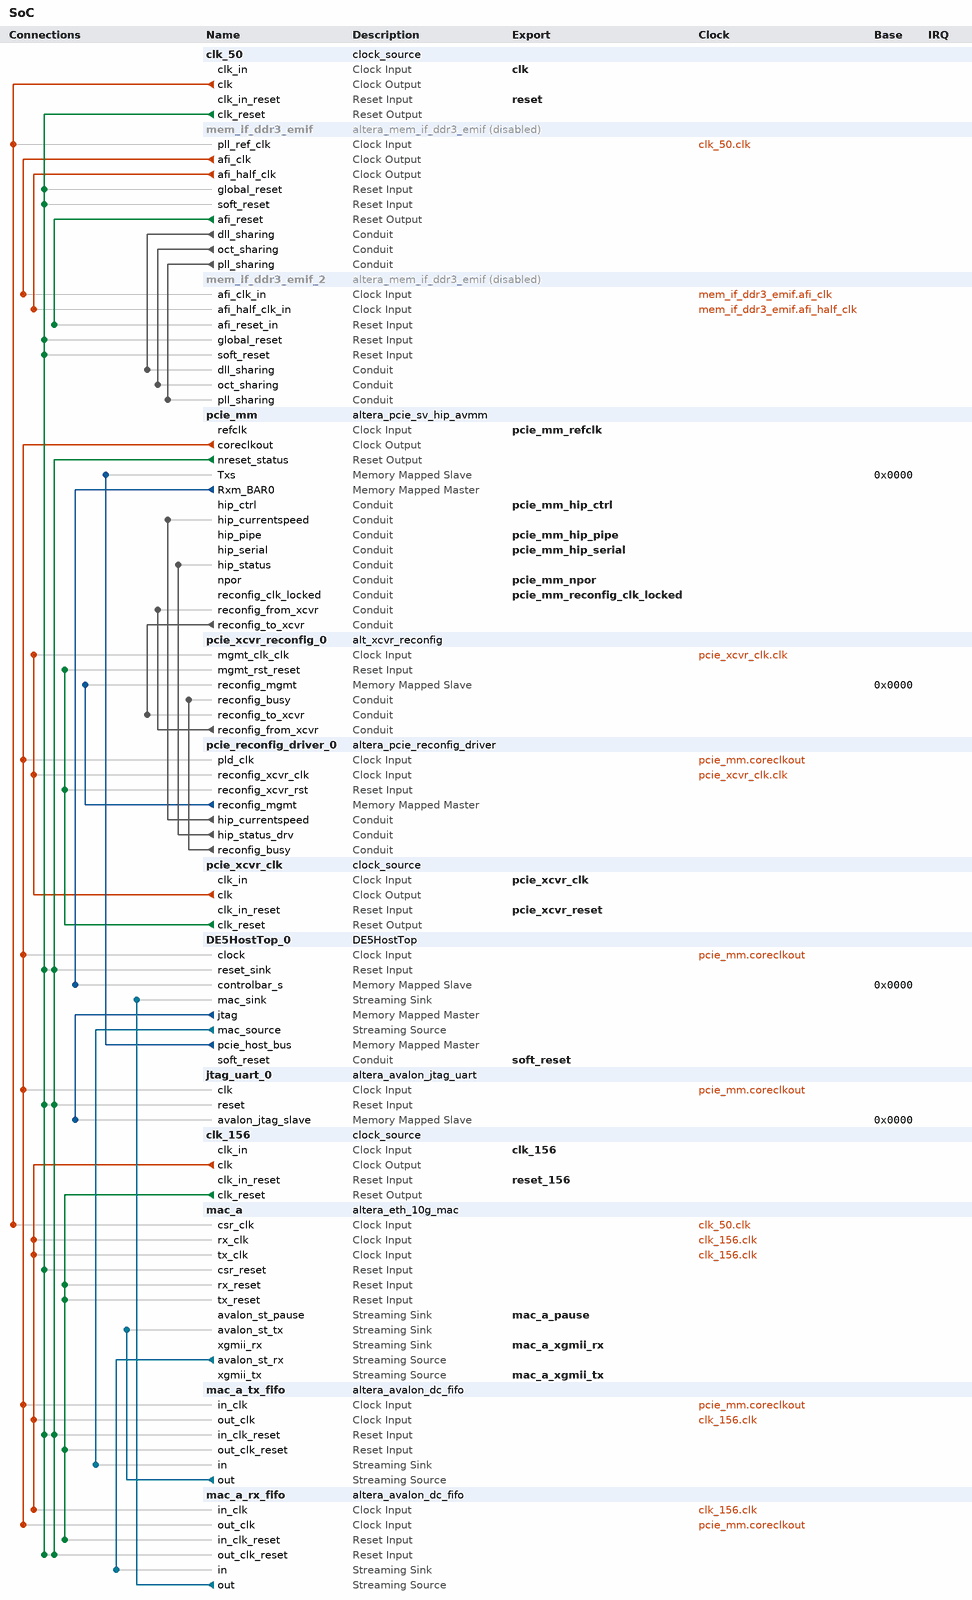
[diagram p0: system contents]
# Platform Designer (Qsys) system SoC, Stratix V 5SGXEA7N2F45C2
# Parameters at their usual value, and those the tool derives, are not listed.
package require -exact qsys 16.0
create_system SoC
set_project_property DEVICE_FAMILY {Stratix V}
set_project_property DEVICE 5SGXEA7N2F45C2

add_instance clk_50 clock_source 16.0
set_instance_parameter_value clk_50 clockFrequency 50000000

add_instance mem_if_ddr3_emif altera_mem_if_ddr3_emif 16.0
set_instance_property mem_if_ddr3_emif ENABLED false
set_instance_parameter_value mem_if_ddr3_emif AVL_MAX_SIZE 8
set_instance_parameter_value mem_if_ddr3_emif CALIBRATION_MODE Skip
set_instance_parameter_value mem_if_ddr3_emif CPORT_TYPE_PORT Bidirectional,Bidirectional,Bidirectional,Bidirectional,Bidirectional,Bidirectional
set_instance_parameter_value mem_if_ddr3_emif DLL_SHARING_MODE Master
set_instance_parameter_value mem_if_ddr3_emif EXPORT_AFI_HALF_CLK false
set_instance_parameter_value mem_if_ddr3_emif HARD_EMIF false
set_instance_parameter_value mem_if_ddr3_emif MEM_BANKADDR_WIDTH 3
set_instance_parameter_value mem_if_ddr3_emif MEM_CLK_FREQ 540.0
set_instance_parameter_value mem_if_ddr3_emif MEM_CLK_FREQ_MAX 800.0
set_instance_parameter_value mem_if_ddr3_emif MEM_COL_ADDR_WIDTH 10
set_instance_parameter_value mem_if_ddr3_emif MEM_DQ_WIDTH 64
set_instance_parameter_value mem_if_ddr3_emif MEM_FORMAT UNBUFFERED
set_instance_parameter_value mem_if_ddr3_emif MEM_ROW_ADDR_WIDTH 14
set_instance_parameter_value mem_if_ddr3_emif MEM_TCL 11
set_instance_parameter_value mem_if_ddr3_emif MEM_TFAW_NS 30.0
set_instance_parameter_value mem_if_ddr3_emif MEM_TRAS_NS 35.0
set_instance_parameter_value mem_if_ddr3_emif MEM_TRCD_NS 13.75
set_instance_parameter_value mem_if_ddr3_emif MEM_TRFC_NS 160.0
set_instance_parameter_value mem_if_ddr3_emif MEM_TRP_NS 13.75
set_instance_parameter_value mem_if_ddr3_emif MEM_TRRD_NS 6.0
set_instance_parameter_value mem_if_ddr3_emif MEM_TRTP_NS 7.5
set_instance_parameter_value mem_if_ddr3_emif MEM_TWTR 4
set_instance_parameter_value mem_if_ddr3_emif MEM_VENDOR Micron
set_instance_parameter_value mem_if_ddr3_emif MEM_WTCL 8
set_instance_parameter_value mem_if_ddr3_emif OCT_SHARING_MODE Master
set_instance_parameter_value mem_if_ddr3_emif PLL_LOCATION Left_Right
set_instance_parameter_value mem_if_ddr3_emif PLL_SHARING_MODE Master
set_instance_parameter_value mem_if_ddr3_emif POWER_OF_TWO_BUS true
set_instance_parameter_value mem_if_ddr3_emif PRIORITY_PORT 0,1,1,1,1,1
set_instance_parameter_value mem_if_ddr3_emif RATE Half
set_instance_parameter_value mem_if_ddr3_emif REF_CLK_FREQ 50.0
set_instance_parameter_value mem_if_ddr3_emif SPEED_GRADE 2
set_instance_parameter_value mem_if_ddr3_emif TIMING_BOARD_AC_SKEW 0.05
set_instance_parameter_value mem_if_ddr3_emif TIMING_BOARD_AC_TO_CK_SKEW 0.012
set_instance_parameter_value mem_if_ddr3_emif TIMING_BOARD_DQ_TO_DQS_SKEW 0.002
set_instance_parameter_value mem_if_ddr3_emif TIMING_BOARD_MAX_CK_DELAY 1.78
set_instance_parameter_value mem_if_ddr3_emif TIMING_BOARD_MAX_DQS_DELAY 0.7
set_instance_parameter_value mem_if_ddr3_emif TIMING_BOARD_SKEW_BETWEEN_DQS 0.1
set_instance_parameter_value mem_if_ddr3_emif TIMING_BOARD_SKEW_CKDQS_DIMM_MAX 1.29
set_instance_parameter_value mem_if_ddr3_emif TIMING_BOARD_SKEW_CKDQS_DIMM_MIN 0.06
set_instance_parameter_value mem_if_ddr3_emif TIMING_BOARD_SKEW_WITHIN_DQS 0.009
set_instance_parameter_value mem_if_ddr3_emif TIMING_TDH 45
set_instance_parameter_value mem_if_ddr3_emif TIMING_TDQSCK 255
set_instance_parameter_value mem_if_ddr3_emif TIMING_TDQSQ 100
set_instance_parameter_value mem_if_ddr3_emif TIMING_TDQSS 0.27
set_instance_parameter_value mem_if_ddr3_emif TIMING_TDS 10
set_instance_parameter_value mem_if_ddr3_emif TIMING_TDSH 0.18
set_instance_parameter_value mem_if_ddr3_emif TIMING_TDSS 0.18
set_instance_parameter_value mem_if_ddr3_emif TIMING_TIH 120
set_instance_parameter_value mem_if_ddr3_emif TIMING_TIS 170
set_instance_parameter_value mem_if_ddr3_emif TIMING_TQSH 0.4
set_instance_parameter_value mem_if_ddr3_emif USER_DEBUG_LEVEL 0

add_instance mem_if_ddr3_emif_2 altera_mem_if_ddr3_emif 16.0
set_instance_property mem_if_ddr3_emif_2 ENABLED false
set_instance_parameter_value mem_if_ddr3_emif_2 AVL_MAX_SIZE 8
set_instance_parameter_value mem_if_ddr3_emif_2 CALIBRATION_MODE Skip
set_instance_parameter_value mem_if_ddr3_emif_2 CPORT_TYPE_PORT Bidirectional,Bidirectional,Bidirectional,Bidirectional,Bidirectional,Bidirectional
set_instance_parameter_value mem_if_ddr3_emif_2 DLL_SHARING_MODE Slave
set_instance_parameter_value mem_if_ddr3_emif_2 EXPORT_AFI_HALF_CLK false
set_instance_parameter_value mem_if_ddr3_emif_2 HARD_EMIF false
set_instance_parameter_value mem_if_ddr3_emif_2 MEM_BANKADDR_WIDTH 3
set_instance_parameter_value mem_if_ddr3_emif_2 MEM_CLK_FREQ 540.0
set_instance_parameter_value mem_if_ddr3_emif_2 MEM_CLK_FREQ_MAX 800.0
set_instance_parameter_value mem_if_ddr3_emif_2 MEM_COL_ADDR_WIDTH 10
set_instance_parameter_value mem_if_ddr3_emif_2 MEM_DQ_WIDTH 64
set_instance_parameter_value mem_if_ddr3_emif_2 MEM_FORMAT UNBUFFERED
set_instance_parameter_value mem_if_ddr3_emif_2 MEM_ROW_ADDR_WIDTH 14
set_instance_parameter_value mem_if_ddr3_emif_2 MEM_TCL 11
set_instance_parameter_value mem_if_ddr3_emif_2 MEM_TFAW_NS 30.0
set_instance_parameter_value mem_if_ddr3_emif_2 MEM_TRAS_NS 35.0
set_instance_parameter_value mem_if_ddr3_emif_2 MEM_TRCD_NS 13.75
set_instance_parameter_value mem_if_ddr3_emif_2 MEM_TRFC_NS 160.0
set_instance_parameter_value mem_if_ddr3_emif_2 MEM_TRP_NS 13.75
set_instance_parameter_value mem_if_ddr3_emif_2 MEM_TRRD_NS 6.0
set_instance_parameter_value mem_if_ddr3_emif_2 MEM_TRTP_NS 7.5
set_instance_parameter_value mem_if_ddr3_emif_2 MEM_TWTR 4
set_instance_parameter_value mem_if_ddr3_emif_2 MEM_VENDOR Micron
set_instance_parameter_value mem_if_ddr3_emif_2 MEM_WTCL 8
set_instance_parameter_value mem_if_ddr3_emif_2 OCT_SHARING_MODE Slave
set_instance_parameter_value mem_if_ddr3_emif_2 PLL_LOCATION Left_Right
set_instance_parameter_value mem_if_ddr3_emif_2 PLL_SHARING_MODE Slave
set_instance_parameter_value mem_if_ddr3_emif_2 POWER_OF_TWO_BUS true
set_instance_parameter_value mem_if_ddr3_emif_2 PRIORITY_PORT 0,1,1,1,1,1
set_instance_parameter_value mem_if_ddr3_emif_2 RATE Half
set_instance_parameter_value mem_if_ddr3_emif_2 REF_CLK_FREQ 50.0
set_instance_parameter_value mem_if_ddr3_emif_2 SPEED_GRADE 2
set_instance_parameter_value mem_if_ddr3_emif_2 TIMING_BOARD_AC_SKEW 0.05
set_instance_parameter_value mem_if_ddr3_emif_2 TIMING_BOARD_AC_TO_CK_SKEW 0.012
set_instance_parameter_value mem_if_ddr3_emif_2 TIMING_BOARD_DQ_TO_DQS_SKEW 0.002
set_instance_parameter_value mem_if_ddr3_emif_2 TIMING_BOARD_MAX_CK_DELAY 1.78
set_instance_parameter_value mem_if_ddr3_emif_2 TIMING_BOARD_MAX_DQS_DELAY 0.7
set_instance_parameter_value mem_if_ddr3_emif_2 TIMING_BOARD_SKEW_BETWEEN_DQS 0.1
set_instance_parameter_value mem_if_ddr3_emif_2 TIMING_BOARD_SKEW_CKDQS_DIMM_MAX 1.29
set_instance_parameter_value mem_if_ddr3_emif_2 TIMING_BOARD_SKEW_CKDQS_DIMM_MIN 0.06
set_instance_parameter_value mem_if_ddr3_emif_2 TIMING_BOARD_SKEW_WITHIN_DQS 0.009
set_instance_parameter_value mem_if_ddr3_emif_2 TIMING_TDH 45
set_instance_parameter_value mem_if_ddr3_emif_2 TIMING_TDQSCK 255
set_instance_parameter_value mem_if_ddr3_emif_2 TIMING_TDQSQ 100
set_instance_parameter_value mem_if_ddr3_emif_2 TIMING_TDQSS 0.27
set_instance_parameter_value mem_if_ddr3_emif_2 TIMING_TDS 10
set_instance_parameter_value mem_if_ddr3_emif_2 TIMING_TDSH 0.18
set_instance_parameter_value mem_if_ddr3_emif_2 TIMING_TDSS 0.18
set_instance_parameter_value mem_if_ddr3_emif_2 TIMING_TIH 120
set_instance_parameter_value mem_if_ddr3_emif_2 TIMING_TIS 170
set_instance_parameter_value mem_if_ddr3_emif_2 TIMING_TQSH 0.4
set_instance_parameter_value mem_if_ddr3_emif_2 USER_DEBUG_LEVEL 0

add_instance pcie_mm altera_pcie_sv_hip_avmm 16.0
set_instance_parameter_value pcie_mm AST_LITE 0
set_instance_parameter_value pcie_mm AVALON_ADDR_WIDTH 64
set_instance_parameter_value pcie_mm AddressPage "0\\,1\\,2\\,3\\,4\\,5\\,6\\,7\\,8\\,9\\,10\\,11\\,12\\,13\\,14\\,15"
set_instance_parameter_value pcie_mm BYPASSS_A2P_TRANSLATION 0
set_instance_parameter_value pcie_mm CB_A2P_ADDR_MAP_FIXED_TABLE_0_HIGH 0
set_instance_parameter_value pcie_mm CB_A2P_ADDR_MAP_FIXED_TABLE_0_LOW 0
set_instance_parameter_value pcie_mm CB_A2P_ADDR_MAP_FIXED_TABLE_10_HIGH 0
set_instance_parameter_value pcie_mm CB_A2P_ADDR_MAP_FIXED_TABLE_10_LOW 0
set_instance_parameter_value pcie_mm CB_A2P_ADDR_MAP_FIXED_TABLE_11_HIGH 0
set_instance_parameter_value pcie_mm CB_A2P_ADDR_MAP_FIXED_TABLE_11_LOW 0
set_instance_parameter_value pcie_mm CB_A2P_ADDR_MAP_FIXED_TABLE_12_HIGH 0
set_instance_parameter_value pcie_mm CB_A2P_ADDR_MAP_FIXED_TABLE_12_LOW 0
set_instance_parameter_value pcie_mm CB_A2P_ADDR_MAP_FIXED_TABLE_13_HIGH 0
set_instance_parameter_value pcie_mm CB_A2P_ADDR_MAP_FIXED_TABLE_13_LOW 0
set_instance_parameter_value pcie_mm CB_A2P_ADDR_MAP_FIXED_TABLE_14_HIGH 0
set_instance_parameter_value pcie_mm CB_A2P_ADDR_MAP_FIXED_TABLE_14_LOW 0
set_instance_parameter_value pcie_mm CB_A2P_ADDR_MAP_FIXED_TABLE_15_HIGH 0
set_instance_parameter_value pcie_mm CB_A2P_ADDR_MAP_FIXED_TABLE_15_LOW 0
set_instance_parameter_value pcie_mm CB_A2P_ADDR_MAP_FIXED_TABLE_1_HIGH 0
set_instance_parameter_value pcie_mm CB_A2P_ADDR_MAP_FIXED_TABLE_1_LOW 0
set_instance_parameter_value pcie_mm CB_A2P_ADDR_MAP_FIXED_TABLE_2_HIGH 0
set_instance_parameter_value pcie_mm CB_A2P_ADDR_MAP_FIXED_TABLE_2_LOW 0
set_instance_parameter_value pcie_mm CB_A2P_ADDR_MAP_FIXED_TABLE_3_HIGH 0
set_instance_parameter_value pcie_mm CB_A2P_ADDR_MAP_FIXED_TABLE_3_LOW 0
set_instance_parameter_value pcie_mm CB_A2P_ADDR_MAP_FIXED_TABLE_4_HIGH 0
set_instance_parameter_value pcie_mm CB_A2P_ADDR_MAP_FIXED_TABLE_4_LOW 0
set_instance_parameter_value pcie_mm CB_A2P_ADDR_MAP_FIXED_TABLE_5_HIGH 0
set_instance_parameter_value pcie_mm CB_A2P_ADDR_MAP_FIXED_TABLE_5_LOW 0
set_instance_parameter_value pcie_mm CB_A2P_ADDR_MAP_FIXED_TABLE_6_HIGH 0
set_instance_parameter_value pcie_mm CB_A2P_ADDR_MAP_FIXED_TABLE_6_LOW 0
set_instance_parameter_value pcie_mm CB_A2P_ADDR_MAP_FIXED_TABLE_7_HIGH 0
set_instance_parameter_value pcie_mm CB_A2P_ADDR_MAP_FIXED_TABLE_7_LOW 0
set_instance_parameter_value pcie_mm CB_A2P_ADDR_MAP_FIXED_TABLE_8_HIGH 0
set_instance_parameter_value pcie_mm CB_A2P_ADDR_MAP_FIXED_TABLE_8_LOW 0
set_instance_parameter_value pcie_mm CB_A2P_ADDR_MAP_FIXED_TABLE_9_HIGH 0
set_instance_parameter_value pcie_mm CB_A2P_ADDR_MAP_FIXED_TABLE_9_LOW 0
set_instance_parameter_value pcie_mm CB_A2P_ADDR_MAP_IS_FIXED 0
set_instance_parameter_value pcie_mm CB_A2P_ADDR_MAP_NUM_ENTRIES 2
set_instance_parameter_value pcie_mm CB_A2P_ADDR_MAP_PASS_THRU_BITS 20
set_instance_parameter_value pcie_mm CB_P2A_AVALON_ADDR_B0 0x00000000
set_instance_parameter_value pcie_mm CB_P2A_AVALON_ADDR_B1 0x00000000
set_instance_parameter_value pcie_mm CB_P2A_AVALON_ADDR_B2 0x00000000
set_instance_parameter_value pcie_mm CB_P2A_AVALON_ADDR_B3 0x00000000
set_instance_parameter_value pcie_mm CB_P2A_AVALON_ADDR_B4 0x00000000
set_instance_parameter_value pcie_mm CB_P2A_AVALON_ADDR_B5 0x00000000
set_instance_parameter_value pcie_mm CB_P2A_FIXED_AVALON_ADDR_B0 0
set_instance_parameter_value pcie_mm CB_P2A_FIXED_AVALON_ADDR_B1 0
set_instance_parameter_value pcie_mm CB_P2A_FIXED_AVALON_ADDR_B2 0
set_instance_parameter_value pcie_mm CB_P2A_FIXED_AVALON_ADDR_B3 0
set_instance_parameter_value pcie_mm CB_P2A_FIXED_AVALON_ADDR_B4 0
set_instance_parameter_value pcie_mm CB_P2A_FIXED_AVALON_ADDR_B5 0
set_instance_parameter_value pcie_mm CB_PCIE_MODE 0
set_instance_parameter_value pcie_mm CB_PCIE_RX_LITE 0
set_instance_parameter_value pcie_mm CB_RP_S_ADDR_WIDTH 32
set_instance_parameter_value pcie_mm CG_COMMON_CLOCK_MODE 1
set_instance_parameter_value pcie_mm CG_ENABLE_A2P_INTERRUPT 0
set_instance_parameter_value pcie_mm CG_ENABLE_ADVANCED_INTERRUPT 0
set_instance_parameter_value pcie_mm CG_ENABLE_HIP_STATUS 1
set_instance_parameter_value pcie_mm CG_ENABLE_HIP_STATUS_EXTENSION 0
set_instance_parameter_value pcie_mm CG_IMPL_CRA_AV_SLAVE_PORT 0
set_instance_parameter_value pcie_mm CG_RXM_IRQ_NUM 16
set_instance_parameter_value pcie_mm NUM_PREFETCH_MASTERS 1
set_instance_parameter_value pcie_mm PCIeAddress31_0 "0x00000000\\,0x00000000\\,0x00000000\\,0x00000000\\,0x00000000\\,0x00000000\\,0x00000000\\,0x00000000\\,0x00000000\\,0x00000000\\,0x00000000\\,0x00000000\\,0x00000000\\,0x00000000\\,0x00000000\\,0x00000000"
set_instance_parameter_value pcie_mm PCIeAddress63_32 "0x00000000\\,0x00000000\\,0x00000000\\,0x00000000\\,0x00000000\\,0x00000000\\,0x00000000\\,0x00000000\\,0x00000000\\,0x00000000\\,0x00000000\\,0x00000000\\,0x00000000\\,0x00000000\\,0x00000000\\,0x00000000"
set_instance_parameter_value pcie_mm RXM_BEN_WIDTH 8
set_instance_parameter_value pcie_mm RXM_DATA_WIDTH 64
set_instance_parameter_value pcie_mm SLAVE_ADDRESS_MAP_0 19
set_instance_parameter_value pcie_mm SLAVE_ADDRESS_MAP_1 0
set_instance_parameter_value pcie_mm SLAVE_ADDRESS_MAP_2 0
set_instance_parameter_value pcie_mm SLAVE_ADDRESS_MAP_3 0
set_instance_parameter_value pcie_mm SLAVE_ADDRESS_MAP_4 0
set_instance_parameter_value pcie_mm SLAVE_ADDRESS_MAP_5 0
set_instance_parameter_value pcie_mm TX_S_ADDR_WIDTH 64
set_instance_parameter_value pcie_mm advanced_default_hwtcl_atomic_malformed true
set_instance_parameter_value pcie_mm advanced_default_hwtcl_atomic_op_completer_32bit false
set_instance_parameter_value pcie_mm advanced_default_hwtcl_atomic_op_completer_64bit false
set_instance_parameter_value pcie_mm advanced_default_hwtcl_atomic_op_routing false
set_instance_parameter_value pcie_mm advanced_default_hwtcl_bridge_port_ssid_support false
set_instance_parameter_value pcie_mm advanced_default_hwtcl_bridge_port_vga_enable false
set_instance_parameter_value pcie_mm advanced_default_hwtcl_bypass_cdc false
set_instance_parameter_value pcie_mm advanced_default_hwtcl_cas_completer_128bit false
set_instance_parameter_value pcie_mm advanced_default_hwtcl_cdc_dummy_insert_limit 11
set_instance_parameter_value pcie_mm advanced_default_hwtcl_d0_pme false
set_instance_parameter_value pcie_mm advanced_default_hwtcl_d1_pme false
set_instance_parameter_value pcie_mm advanced_default_hwtcl_d1_support false
set_instance_parameter_value pcie_mm advanced_default_hwtcl_d2_pme false
set_instance_parameter_value pcie_mm advanced_default_hwtcl_d2_support false
set_instance_parameter_value pcie_mm advanced_default_hwtcl_d3_cold_pme false
set_instance_parameter_value pcie_mm advanced_default_hwtcl_d3_hot_pme false
set_instance_parameter_value pcie_mm advanced_default_hwtcl_data_pack_rx disable
set_instance_parameter_value pcie_mm advanced_default_hwtcl_deskew_comma com_deskw
set_instance_parameter_value pcie_mm advanced_default_hwtcl_device_number 0
set_instance_parameter_value pcie_mm advanced_default_hwtcl_disable_link_x2_support false
set_instance_parameter_value pcie_mm advanced_default_hwtcl_disable_snoop_packet false
set_instance_parameter_value pcie_mm advanced_default_hwtcl_ei_delay_powerdown_count 10
set_instance_parameter_value pcie_mm advanced_default_hwtcl_eie_before_nfts_count 4
set_instance_parameter_value pcie_mm advanced_default_hwtcl_enable_adapter_half_rate_mode false
set_instance_parameter_value pcie_mm advanced_default_hwtcl_enable_l1_aspm false
set_instance_parameter_value pcie_mm advanced_default_hwtcl_enable_rx_buffer_checking false
set_instance_parameter_value pcie_mm advanced_default_hwtcl_extended_format_field false
set_instance_parameter_value pcie_mm advanced_default_hwtcl_extended_tag_reset false
set_instance_parameter_value pcie_mm advanced_default_hwtcl_fc_init_timer 1024
set_instance_parameter_value pcie_mm advanced_default_hwtcl_flow_control_timeout_count 200
set_instance_parameter_value pcie_mm advanced_default_hwtcl_flow_control_update_count 30
set_instance_parameter_value pcie_mm advanced_default_hwtcl_flr_capability false
set_instance_parameter_value pcie_mm advanced_default_hwtcl_gen2_diffclock_nfts_count 255
set_instance_parameter_value pcie_mm advanced_default_hwtcl_gen2_sameclock_nfts_count 255
set_instance_parameter_value pcie_mm advanced_default_hwtcl_hot_plug_support 0
set_instance_parameter_value pcie_mm advanced_default_hwtcl_interrupt_pin inta
set_instance_parameter_value pcie_mm advanced_default_hwtcl_l01_entry_latency 31
set_instance_parameter_value pcie_mm advanced_default_hwtcl_l0_exit_latency_diffclock 6
set_instance_parameter_value pcie_mm advanced_default_hwtcl_l0_exit_latency_sameclock 6
set_instance_parameter_value pcie_mm advanced_default_hwtcl_l1_exit_latency_diffclock 0
set_instance_parameter_value pcie_mm advanced_default_hwtcl_l1_exit_latency_sameclock 0
set_instance_parameter_value pcie_mm advanced_default_hwtcl_low_priority_vc single_vc
set_instance_parameter_value pcie_mm advanced_default_hwtcl_ltr_mechanism false
set_instance_parameter_value pcie_mm advanced_default_hwtcl_ltssm_1ms_timeout disable
set_instance_parameter_value pcie_mm advanced_default_hwtcl_ltssm_freqlocked_check disable
set_instance_parameter_value pcie_mm advanced_default_hwtcl_maximum_current 0
set_instance_parameter_value pcie_mm advanced_default_hwtcl_no_command_completed false
set_instance_parameter_value pcie_mm advanced_default_hwtcl_no_soft_reset false
set_instance_parameter_value pcie_mm advanced_default_hwtcl_pclk_out_sel pclk
set_instance_parameter_value pcie_mm advanced_default_hwtcl_pipex1_debug_sel disable
set_instance_parameter_value pcie_mm advanced_default_hwtcl_register_pipe_signals false
set_instance_parameter_value pcie_mm advanced_default_hwtcl_reserved_debug 0
set_instance_parameter_value pcie_mm advanced_default_hwtcl_retry_buffer_last_active_address 2047
set_instance_parameter_value pcie_mm advanced_default_hwtcl_rx_l0s_count_idl 0
set_instance_parameter_value pcie_mm advanced_default_hwtcl_set_l0s 0
set_instance_parameter_value pcie_mm advanced_default_hwtcl_skp_os_gen3_count 0
set_instance_parameter_value pcie_mm advanced_default_hwtcl_skp_os_schedule_count 0
set_instance_parameter_value pcie_mm advanced_default_hwtcl_ssid 0
set_instance_parameter_value pcie_mm advanced_default_hwtcl_ssvid 0
set_instance_parameter_value pcie_mm advanced_default_hwtcl_tph_completer false
set_instance_parameter_value pcie_mm advanced_default_hwtcl_tx_cdc_almost_empty 5
set_instance_parameter_value pcie_mm advanced_default_hwtcl_vc0_clk_enable true
set_instance_parameter_value pcie_mm advanced_default_hwtcl_wrong_device_id disable
set_instance_parameter_value pcie_mm advanced_default_parameter_override 0
set_instance_parameter_value pcie_mm avmm_width_hwtcl 128
set_instance_parameter_value pcie_mm bar0_type_hwtcl 1
set_instance_parameter_value pcie_mm bar1_type_hwtcl 0
set_instance_parameter_value pcie_mm bar2_type_hwtcl 0
set_instance_parameter_value pcie_mm bar3_type_hwtcl 0
set_instance_parameter_value pcie_mm bar4_type_hwtcl 0
set_instance_parameter_value pcie_mm bar5_type_hwtcl 0
set_instance_parameter_value pcie_mm bypass_tl false
set_instance_parameter_value pcie_mm class_code_hwtcl 0
set_instance_parameter_value pcie_mm completion_timeout_hwtcl ABCD
set_instance_parameter_value pcie_mm device_id_hwtcl 3557
set_instance_parameter_value pcie_mm dll_active_report_support_hwtcl 0
set_instance_parameter_value pcie_mm ecrc_check_capable_hwtcl 0
set_instance_parameter_value pcie_mm ecrc_gen_capable_hwtcl 0
set_instance_parameter_value pcie_mm enable_completion_timeout_disable_hwtcl 1
set_instance_parameter_value pcie_mm enable_function_msix_support_hwtcl 0
set_instance_parameter_value pcie_mm enable_pcisigtest_hwtcl 0
set_instance_parameter_value pcie_mm enable_power_on_rst_pulse_hwtcl 0
set_instance_parameter_value pcie_mm enable_slot_register_hwtcl 0
set_instance_parameter_value pcie_mm enable_tl_only_sim_hwtcl 0
set_instance_parameter_value pcie_mm endpoint_l0_latency_hwtcl 0
set_instance_parameter_value pcie_mm endpoint_l1_latency_hwtcl 0
set_instance_parameter_value pcie_mm expansion_base_address_register_hwtcl 0
set_instance_parameter_value pcie_mm extend_tag_field_hwtcl 32
set_instance_parameter_value pcie_mm fixed_address_mode 0
set_instance_parameter_value pcie_mm force_hrc 0
set_instance_parameter_value pcie_mm force_src 0
set_instance_parameter_value pcie_mm gen123_lane_rate_mode_hwtcl {Gen2 (5.0 Gbps)}
set_instance_parameter_value pcie_mm gen3_rxfreqlock_counter_hwtcl 0
set_instance_parameter_value pcie_mm hip_reconfig_hwtcl 0
set_instance_parameter_value pcie_mm hip_tag_checking_hwtcl 1
set_instance_parameter_value pcie_mm hwtcl_override_g2_txvod 1
set_instance_parameter_value pcie_mm in_cvp_mode_hwtcl 0
set_instance_parameter_value pcie_mm io_window_addr_width_hwtcl 0
set_instance_parameter_value pcie_mm lane_mask_hwtcl x8
set_instance_parameter_value pcie_mm max_payload_size_hwtcl 128
set_instance_parameter_value pcie_mm msi_64bit_addressing_capable_hwtcl true
set_instance_parameter_value pcie_mm msi_masking_capable_hwtcl false
set_instance_parameter_value pcie_mm msi_multi_message_capable_hwtcl 4
set_instance_parameter_value pcie_mm msi_support_hwtcl true
set_instance_parameter_value pcie_mm msix_pba_bir_hwtcl 0
set_instance_parameter_value pcie_mm msix_pba_offset_hwtcl 0
set_instance_parameter_value pcie_mm msix_table_bir_hwtcl 0
set_instance_parameter_value pcie_mm msix_table_offset_hwtcl 0
set_instance_parameter_value pcie_mm msix_table_size_hwtcl 0
set_instance_parameter_value pcie_mm override_rxbuffer_cred_preset 0
set_instance_parameter_value pcie_mm override_tbpartner_driver_setting_hwtcl 0
set_instance_parameter_value pcie_mm pcie_inspector_hwtcl 0
set_instance_parameter_value pcie_mm pcie_qsys 1
set_instance_parameter_value pcie_mm pll_refclk_freq_hwtcl {100 MHz}
set_instance_parameter_value pcie_mm port_link_number_hwtcl 1
set_instance_parameter_value pcie_mm port_type_hwtcl {Native endpoint}
set_instance_parameter_value pcie_mm prefetchable_mem_window_addr_width_hwtcl 0
set_instance_parameter_value pcie_mm revision_id_hwtcl 1
set_instance_parameter_value pcie_mm rpre_emph_a_val_hwtcl 9
set_instance_parameter_value pcie_mm rpre_emph_b_val_hwtcl 0
set_instance_parameter_value pcie_mm rpre_emph_c_val_hwtcl 16
set_instance_parameter_value pcie_mm rpre_emph_d_val_hwtcl 13
set_instance_parameter_value pcie_mm rpre_emph_e_val_hwtcl 5
set_instance_parameter_value pcie_mm rvod_sel_a_val_hwtcl 42
set_instance_parameter_value pcie_mm rvod_sel_b_val_hwtcl 38
set_instance_parameter_value pcie_mm rvod_sel_c_val_hwtcl 38
set_instance_parameter_value pcie_mm rvod_sel_d_val_hwtcl 43
set_instance_parameter_value pcie_mm rvod_sel_e_val_hwtcl 15
set_instance_parameter_value pcie_mm rxbuffer_rxreq_hwtcl Low
set_instance_parameter_value pcie_mm serial_sim_hwtcl 1
set_instance_parameter_value pcie_mm set_pld_clk_x1_625MHz_hwtcl 0
set_instance_parameter_value pcie_mm slot_number_hwtcl 0
set_instance_parameter_value pcie_mm slot_power_limit_hwtcl 0
set_instance_parameter_value pcie_mm slot_power_scale_hwtcl 0
set_instance_parameter_value pcie_mm slotclkcfg_hwtcl 1
set_instance_parameter_value pcie_mm subsystem_device_id_hwtcl 0
set_instance_parameter_value pcie_mm subsystem_vendor_id_hwtcl 0
set_instance_parameter_value pcie_mm surprise_down_error_support_hwtcl 0
set_instance_parameter_value pcie_mm tlp_insp_trg_dw0_hwtcl 2049
set_instance_parameter_value pcie_mm tlp_insp_trg_dw1_hwtcl 0
set_instance_parameter_value pcie_mm tlp_insp_trg_dw2_hwtcl 0
set_instance_parameter_value pcie_mm tlp_insp_trg_dw3_hwtcl 0
set_instance_parameter_value pcie_mm tlp_inspector_hwtcl 0
set_instance_parameter_value pcie_mm tlp_inspector_use_signal_probe_hwtcl 0
set_instance_parameter_value pcie_mm use_aer_hwtcl 0
set_instance_parameter_value pcie_mm use_ast_parity 0
set_instance_parameter_value pcie_mm use_atx_pll_hwtcl 0
set_instance_parameter_value pcie_mm use_crc_forwarding_hwtcl 0
set_instance_parameter_value pcie_mm use_cvp_update_core_pof_hwtcl 0
set_instance_parameter_value pcie_mm use_rx_st_be_hwtcl 0
set_instance_parameter_value pcie_mm user_id_hwtcl 0
set_instance_parameter_value pcie_mm vendor_id_hwtcl 4466
set_instance_parameter_value pcie_mm vsec_id_hwtcl 4466
set_instance_parameter_value pcie_mm vsec_rev_hwtcl 0

add_instance pcie_xcvr_reconfig_0 alt_xcvr_reconfig 16.0
set_instance_parameter_value pcie_xcvr_reconfig_0 device_family {Stratix V}
set_instance_parameter_value pcie_xcvr_reconfig_0 enable_adce 0
set_instance_parameter_value pcie_xcvr_reconfig_0 enable_analog 1
set_instance_parameter_value pcie_xcvr_reconfig_0 number_of_reconfig_interfaces 10

add_instance pcie_reconfig_driver_0 altera_pcie_reconfig_driver 16.0
set_instance_parameter_value pcie_reconfig_driver_0 gen123_lane_rate_mode_hwtcl {Gen2 (5.0 Gbps)}
set_instance_parameter_value pcie_reconfig_driver_0 number_of_reconfig_interfaces 4

add_instance pcie_xcvr_clk clock_source 16.0
set_instance_parameter_value pcie_xcvr_clk clockFrequency 50000000

add_instance DE5HostTop_0 DE5HostTop 1.0

add_instance jtag_uart_0 altera_avalon_jtag_uart 16.0
set_instance_parameter_value jtag_uart_0 simInteractiveOptions NO_INTERACTIVE_WINDOWS

add_instance clk_156 clock_source 16.0
set_instance_parameter_value clk_156 clockFrequency 156250000

add_instance mac_a altera_eth_10g_mac 16.0
set_instance_parameter_value mac_a DATAPATH_OPTION 3
set_instance_parameter_value mac_a ENABLE_1G10G_MAC 0
set_instance_parameter_value mac_a ENABLE_PFC 0
set_instance_parameter_value mac_a ENABLE_PTP_1STEP 0
set_instance_parameter_value mac_a ENABLE_SUPP_ADDR 0
set_instance_parameter_value mac_a ENABLE_TIMESTAMPING 0
set_instance_parameter_value mac_a ENABLE_UNIDIRECTIONAL 0
set_instance_parameter_value mac_a INSTANTIATE_STATISTICS 0
set_instance_parameter_value mac_a INSTANTIATE_TX_CRC 1
set_instance_parameter_value mac_a PFC_PRIORITY_NUM 8
set_instance_parameter_value mac_a PREAMBLE_PASSTHROUGH 0
set_instance_parameter_value mac_a REGISTER_BASED_STATISTICS 0
set_instance_parameter_value mac_a TSTAMP_FP_WIDTH 4

add_instance mac_a_tx_fifo altera_avalon_dc_fifo 16.0
set_instance_parameter_value mac_a_tx_fifo BITS_PER_SYMBOL 8
set_instance_parameter_value mac_a_tx_fifo ERROR_WIDTH 1
set_instance_parameter_value mac_a_tx_fifo FIFO_DEPTH 256
set_instance_parameter_value mac_a_tx_fifo SYMBOLS_PER_BEAT 8
set_instance_parameter_value mac_a_tx_fifo USE_PACKETS 1

add_instance mac_a_rx_fifo altera_avalon_dc_fifo 16.0
set_instance_parameter_value mac_a_rx_fifo BITS_PER_SYMBOL 8
set_instance_parameter_value mac_a_rx_fifo ERROR_WIDTH 6
set_instance_parameter_value mac_a_rx_fifo FIFO_DEPTH 256
set_instance_parameter_value mac_a_rx_fifo SYMBOLS_PER_BEAT 8
set_instance_parameter_value mac_a_rx_fifo USE_PACKETS 1

# connections
add_connection clk_50.clk mac_a.csr_clk clock
add_connection clk_50.clk mem_if_ddr3_emif.pll_ref_clk clock
add_connection clk_156.clk mac_a.rx_clk clock
add_connection clk_156.clk mac_a.tx_clk clock
add_connection clk_156.clk mac_a_rx_fifo.in_clk clock
add_connection clk_156.clk mac_a_tx_fifo.out_clk clock
add_connection mem_if_ddr3_emif.afi_clk mem_if_ddr3_emif_2.afi_clk_in clock
add_connection mem_if_ddr3_emif.afi_half_clk mem_if_ddr3_emif_2.afi_half_clk_in clock
add_connection pcie_mm.coreclkout DE5HostTop_0.clock clock
add_connection pcie_mm.coreclkout jtag_uart_0.clk clock
add_connection pcie_mm.coreclkout mac_a_rx_fifo.out_clk clock
add_connection pcie_mm.coreclkout mac_a_tx_fifo.in_clk clock
add_connection pcie_mm.coreclkout pcie_reconfig_driver_0.pld_clk clock
add_connection pcie_xcvr_clk.clk pcie_reconfig_driver_0.reconfig_xcvr_clk clock
add_connection pcie_xcvr_clk.clk pcie_xcvr_reconfig_0.mgmt_clk_clk clock
add_connection clk_50.clk_reset DE5HostTop_0.reset_sink reset
add_connection clk_50.clk_reset jtag_uart_0.reset reset
add_connection clk_50.clk_reset mac_a.csr_reset reset
add_connection clk_50.clk_reset mac_a_rx_fifo.out_clk_reset reset
add_connection clk_50.clk_reset mac_a_tx_fifo.in_clk_reset reset
add_connection clk_50.clk_reset mem_if_ddr3_emif.global_reset reset
add_connection clk_50.clk_reset mem_if_ddr3_emif.soft_reset reset
add_connection clk_50.clk_reset mem_if_ddr3_emif_2.global_reset reset
add_connection clk_50.clk_reset mem_if_ddr3_emif_2.soft_reset reset
add_connection clk_156.clk_reset mac_a.rx_reset reset
add_connection clk_156.clk_reset mac_a.tx_reset reset
add_connection clk_156.clk_reset mac_a_rx_fifo.in_clk_reset reset
add_connection clk_156.clk_reset mac_a_tx_fifo.out_clk_reset reset
add_connection mem_if_ddr3_emif.afi_reset mem_if_ddr3_emif_2.afi_reset_in reset
add_connection pcie_mm.nreset_status DE5HostTop_0.reset_sink reset
add_connection pcie_mm.nreset_status jtag_uart_0.reset reset
add_connection pcie_mm.nreset_status mac_a_rx_fifo.out_clk_reset reset
add_connection pcie_mm.nreset_status mac_a_tx_fifo.in_clk_reset reset
add_connection pcie_xcvr_clk.clk_reset pcie_reconfig_driver_0.reconfig_xcvr_rst reset
add_connection pcie_xcvr_clk.clk_reset pcie_xcvr_reconfig_0.mgmt_rst_reset reset
add_connection DE5HostTop_0.jtag jtag_uart_0.avalon_jtag_slave avalon
set_connection_parameter_value DE5HostTop_0.jtag/jtag_uart_0.avalon_jtag_slave baseAddress 0x0000
add_connection DE5HostTop_0.pcie_host_bus pcie_mm.Txs avalon
set_connection_parameter_value DE5HostTop_0.pcie_host_bus/pcie_mm.Txs baseAddress 0x0000
add_connection pcie_mm.Rxm_BAR0 DE5HostTop_0.controlbar_s avalon
set_connection_parameter_value pcie_mm.Rxm_BAR0/DE5HostTop_0.controlbar_s baseAddress 0x0000
add_connection pcie_reconfig_driver_0.reconfig_mgmt pcie_xcvr_reconfig_0.reconfig_mgmt avalon
set_connection_parameter_value pcie_reconfig_driver_0.reconfig_mgmt/pcie_xcvr_reconfig_0.reconfig_mgmt baseAddress 0x0000
add_connection DE5HostTop_0.mac_source mac_a_tx_fifo.in avalon_streaming
add_connection mac_a.avalon_st_rx mac_a_rx_fifo.in avalon_streaming
add_connection mac_a_rx_fifo.out DE5HostTop_0.mac_sink avalon_streaming
add_connection mac_a_tx_fifo.out mac_a.avalon_st_tx avalon_streaming
add_connection mem_if_ddr3_emif.dll_sharing mem_if_ddr3_emif_2.dll_sharing conduit
add_connection mem_if_ddr3_emif.oct_sharing mem_if_ddr3_emif_2.oct_sharing conduit
add_connection mem_if_ddr3_emif.pll_sharing mem_if_ddr3_emif_2.pll_sharing conduit
add_connection pcie_mm.reconfig_to_xcvr pcie_xcvr_reconfig_0.reconfig_to_xcvr conduit
add_connection pcie_reconfig_driver_0.hip_currentspeed pcie_mm.hip_currentspeed conduit
add_connection pcie_reconfig_driver_0.hip_status_drv pcie_mm.hip_status conduit
add_connection pcie_reconfig_driver_0.reconfig_busy pcie_xcvr_reconfig_0.reconfig_busy conduit
add_connection pcie_xcvr_reconfig_0.reconfig_from_xcvr pcie_mm.reconfig_from_xcvr conduit

# exported interfaces
add_interface clk clock sink
set_interface_property clk EXPORT_OF clk_50.clk_in
add_interface clk_156 clock sink
set_interface_property clk_156 EXPORT_OF clk_156.clk_in
add_interface mac_a_pause avalon_streaming sink
set_interface_property mac_a_pause EXPORT_OF mac_a.avalon_st_pause
add_interface mac_a_xgmii_rx avalon_streaming sink
set_interface_property mac_a_xgmii_rx EXPORT_OF mac_a.xgmii_rx
add_interface mac_a_xgmii_tx avalon_streaming source
set_interface_property mac_a_xgmii_tx EXPORT_OF mac_a.xgmii_tx
add_interface pcie_mm_hip_ctrl conduit end
set_interface_property pcie_mm_hip_ctrl EXPORT_OF pcie_mm.hip_ctrl
add_interface pcie_mm_hip_pipe conduit end
set_interface_property pcie_mm_hip_pipe EXPORT_OF pcie_mm.hip_pipe
add_interface pcie_mm_hip_serial conduit end
set_interface_property pcie_mm_hip_serial EXPORT_OF pcie_mm.hip_serial
add_interface pcie_mm_npor conduit end
set_interface_property pcie_mm_npor EXPORT_OF pcie_mm.npor
add_interface pcie_mm_reconfig_clk_locked conduit end
set_interface_property pcie_mm_reconfig_clk_locked EXPORT_OF pcie_mm.reconfig_clk_locked
add_interface pcie_mm_refclk clock sink
set_interface_property pcie_mm_refclk EXPORT_OF pcie_mm.refclk
add_interface pcie_xcvr_clk clock sink
set_interface_property pcie_xcvr_clk EXPORT_OF pcie_xcvr_clk.clk_in
add_interface pcie_xcvr_reset reset sink
set_interface_property pcie_xcvr_reset EXPORT_OF pcie_xcvr_clk.clk_in_reset
add_interface reset reset sink
set_interface_property reset EXPORT_OF clk_50.clk_in_reset
add_interface reset_156 reset sink
set_interface_property reset_156 EXPORT_OF clk_156.clk_in_reset
add_interface soft_reset conduit end
set_interface_property soft_reset EXPORT_OF DE5HostTop_0.soft_reset

set_interconnect_requirement {$system} qsys_mm.clockCrossingAdapter FIFO
set_interconnect_requirement {$system} qsys_mm.maxAdditionalLatency 4

save_system SoC.qsys
